# EAGLE schematic Arduino_Shield_6_5_19_REV4 (EAGLE 9.3.1)

## Sheet 1 of 2
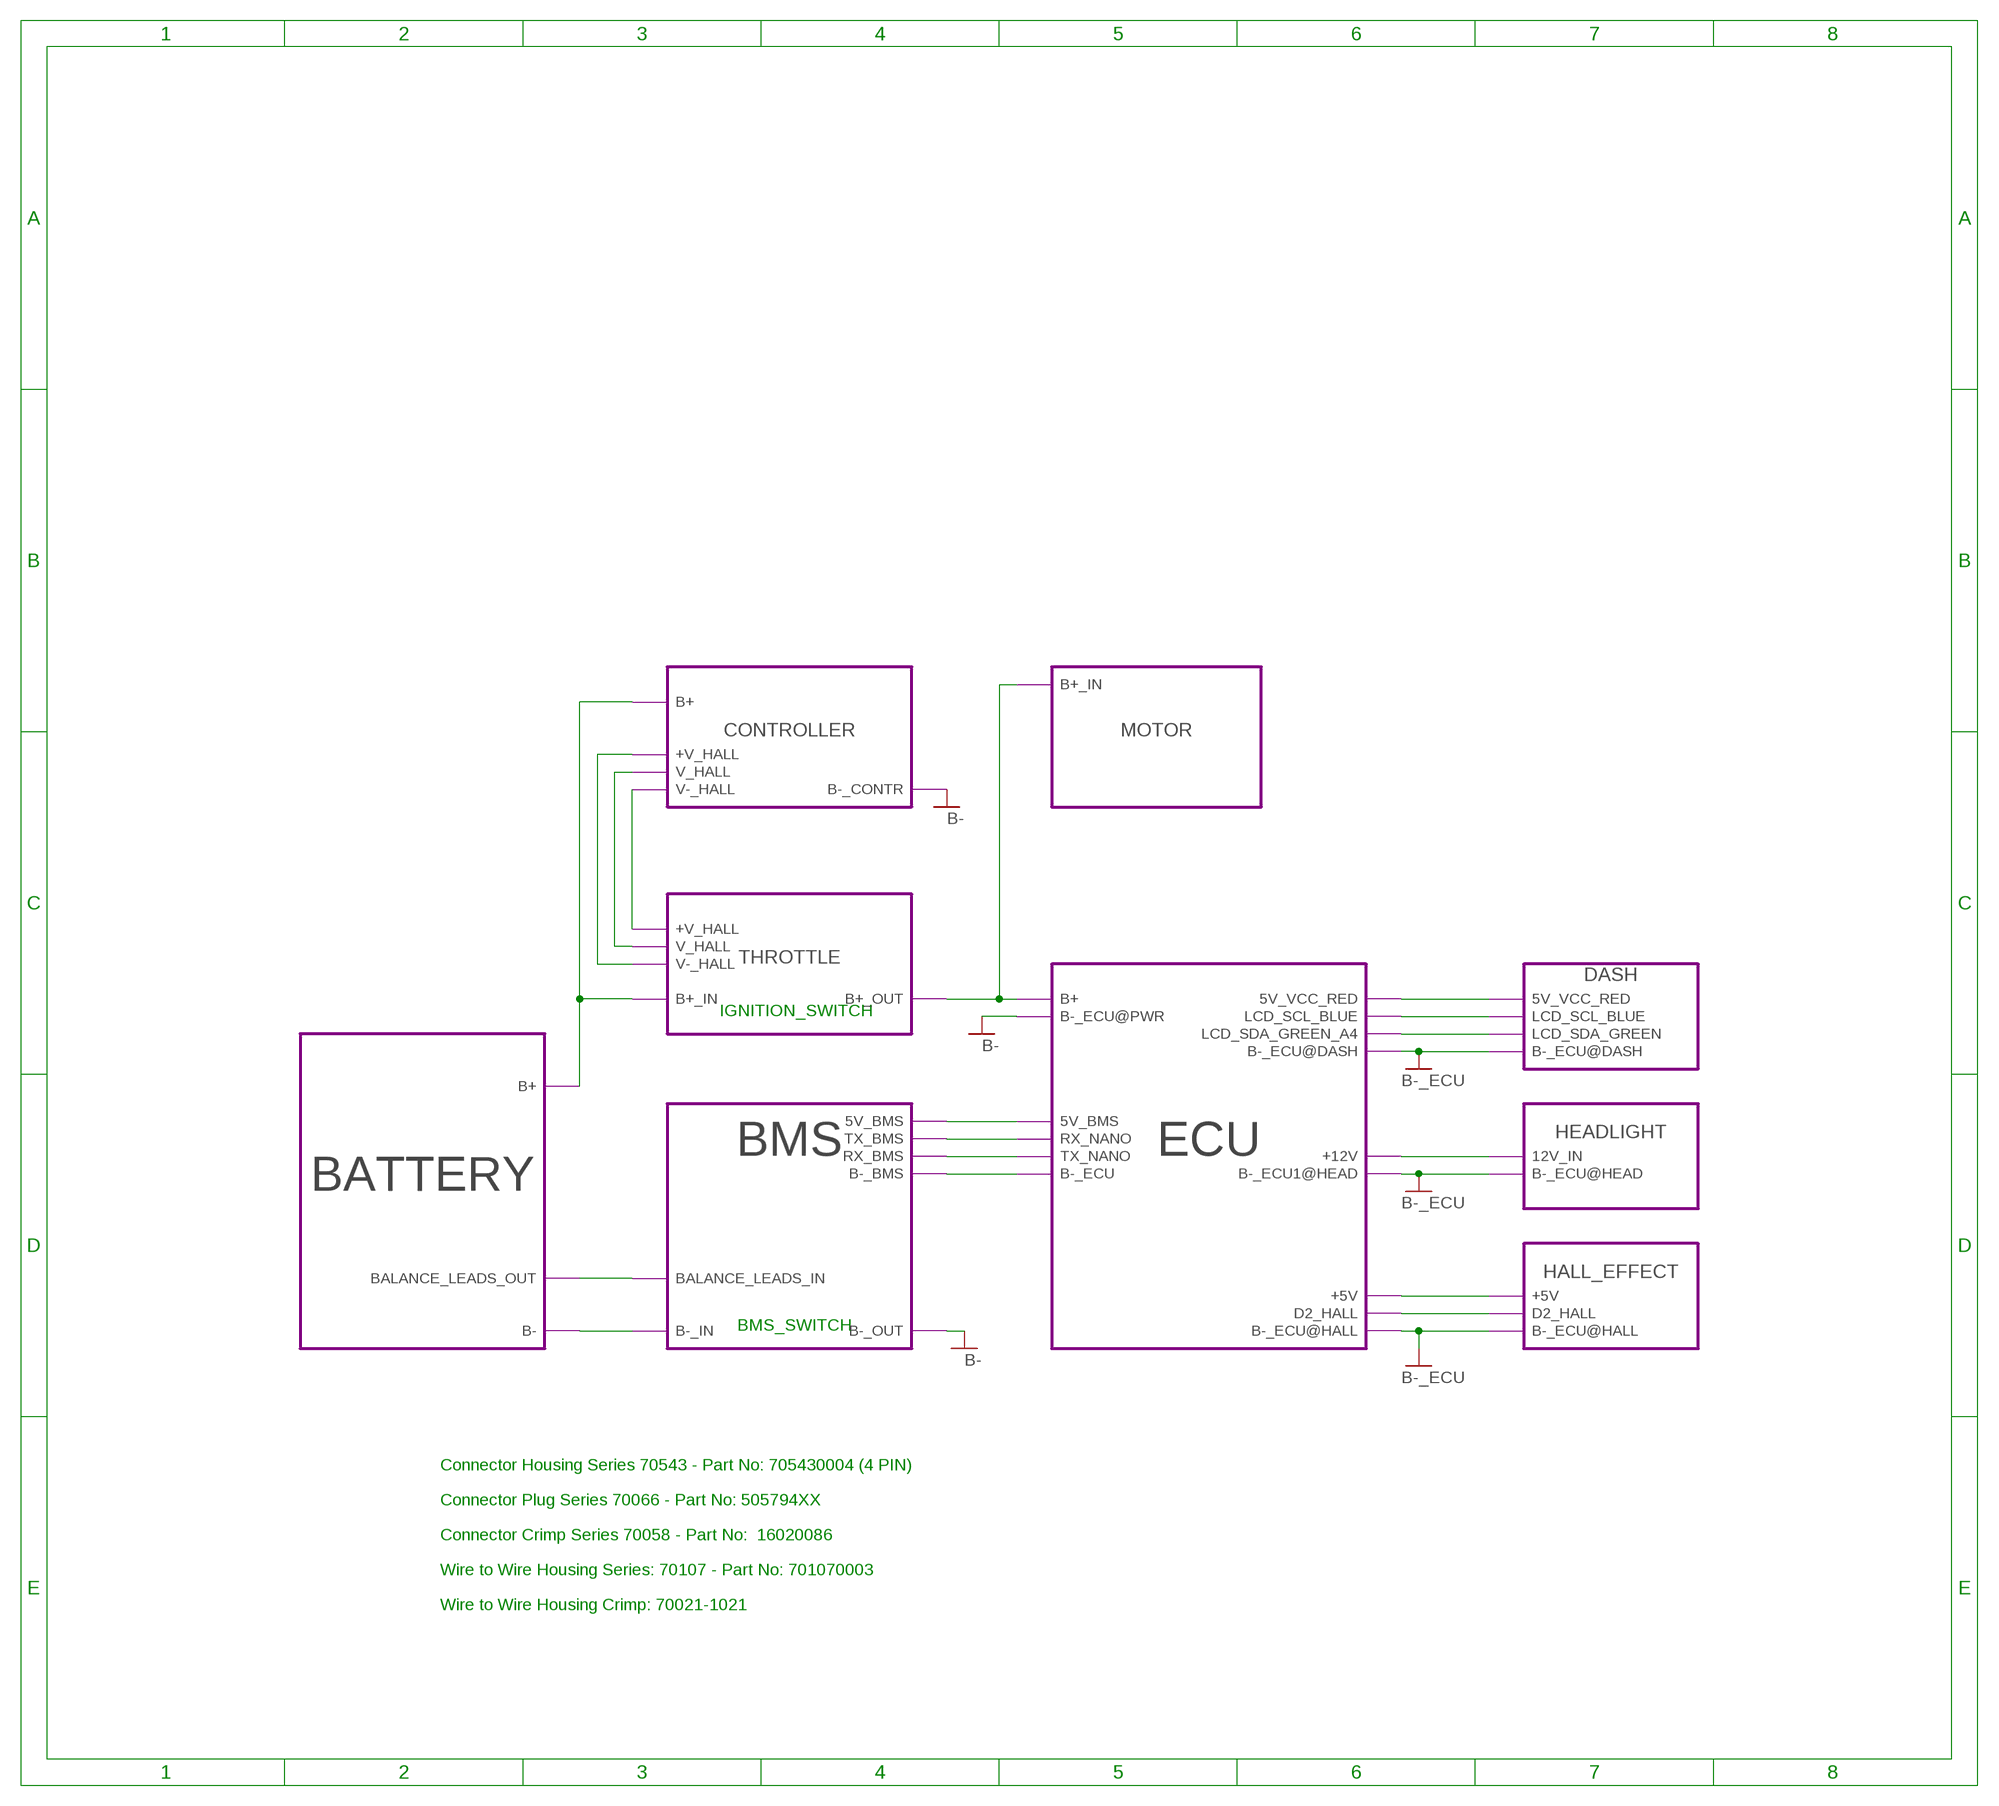
[diagram p0: schematic, sheet 1]

### Module instances
BMS = BMS
BATTERY = BATTERY
ECU = EBIKE_SYSTEM
HALL_EFFECT = HALL_EFFECT_SENSOR
DASH = HEADLIGHT/DISPLAY
HEADLIGHT = HEADLIGHT
THROTTLE = THROTTLE
CONTROLLER = CONTROLLER
MOTOR = MOTOR

### Nets
+5V: port ECU.+5V HALL_EFFECT.+5V ; also sheet 2
+12V: port ECU.+12V HEADLIGHT.12V_IN ; also sheet 2
B+: port MOTOR.B+_IN ECU.B+ THROTTLE.B+_OUT ; also sheet 2
B-: port ECU.B-_ECU@PWR CONTROLLER.B-_CONTR BMS.B-_OUT
B-_ECU: port ECU.B-_ECU@HALL HALL_EFFECT.B-_ECU@HALL ECU.B-_ECU1@HEAD HEADLIGHT.B-_ECU@HEAD ECU.B-_ECU@DASH DASH.B-_ECU@DASH BMS.B-_BMS ECU.B-_ECU ; also sheet 2
LCD_SCL: port ECU.LCD_SCL_BLUE DASH.LCD_SCL_BLUE
LCD_SDA: port ECU.LCD_SDA_GREEN_A4 DASH.LCD_SDA_GREEN
N$1: port BATTERY.B- BMS.B-_IN
N$2: port ECU.5V_VCC_RED DASH.5V_VCC_RED
N$3: port ECU.D2_HALL HALL_EFFECT.D2_HALL
N$5: port CONTROLLER.B+ BATTERY.B+ THROTTLE.B+_IN
N$6: port BMS.5V_BMS ECU.5V_BMS
N$9: port THROTTLE.+V_HALL CONTROLLER.V-_HALL
N$11: port BMS.BALANCE_LEADS_IN BATTERY.BALANCE_LEADS_OUT
N$15: port THROTTLE.V_HALL CONTROLLER.V_HALL
N$16: port CONTROLLER.+V_HALL THROTTLE.V-_HALL
RX_NANO: port BMS.TX_BMS ECU.RX_NANO
TX_NANO: port BMS.RX_BMS ECU.TX_NANO

### Notes on the sheet
- IGNITION_SWITCH
- BMS_SWITCH
- Connector Housing Series 70543 - Part No: 705430004 (4 PIN)
- Connector Plug Series 70066 - Part No: 505794XX
- Connector Crimp Series 70058 - Part No:  16020086
- Wire to Wire Housing Series: 70107 - Part No: 701070003
- Wire to Wire Housing Crimp: 70021-1021

## Sheet 2 of 2
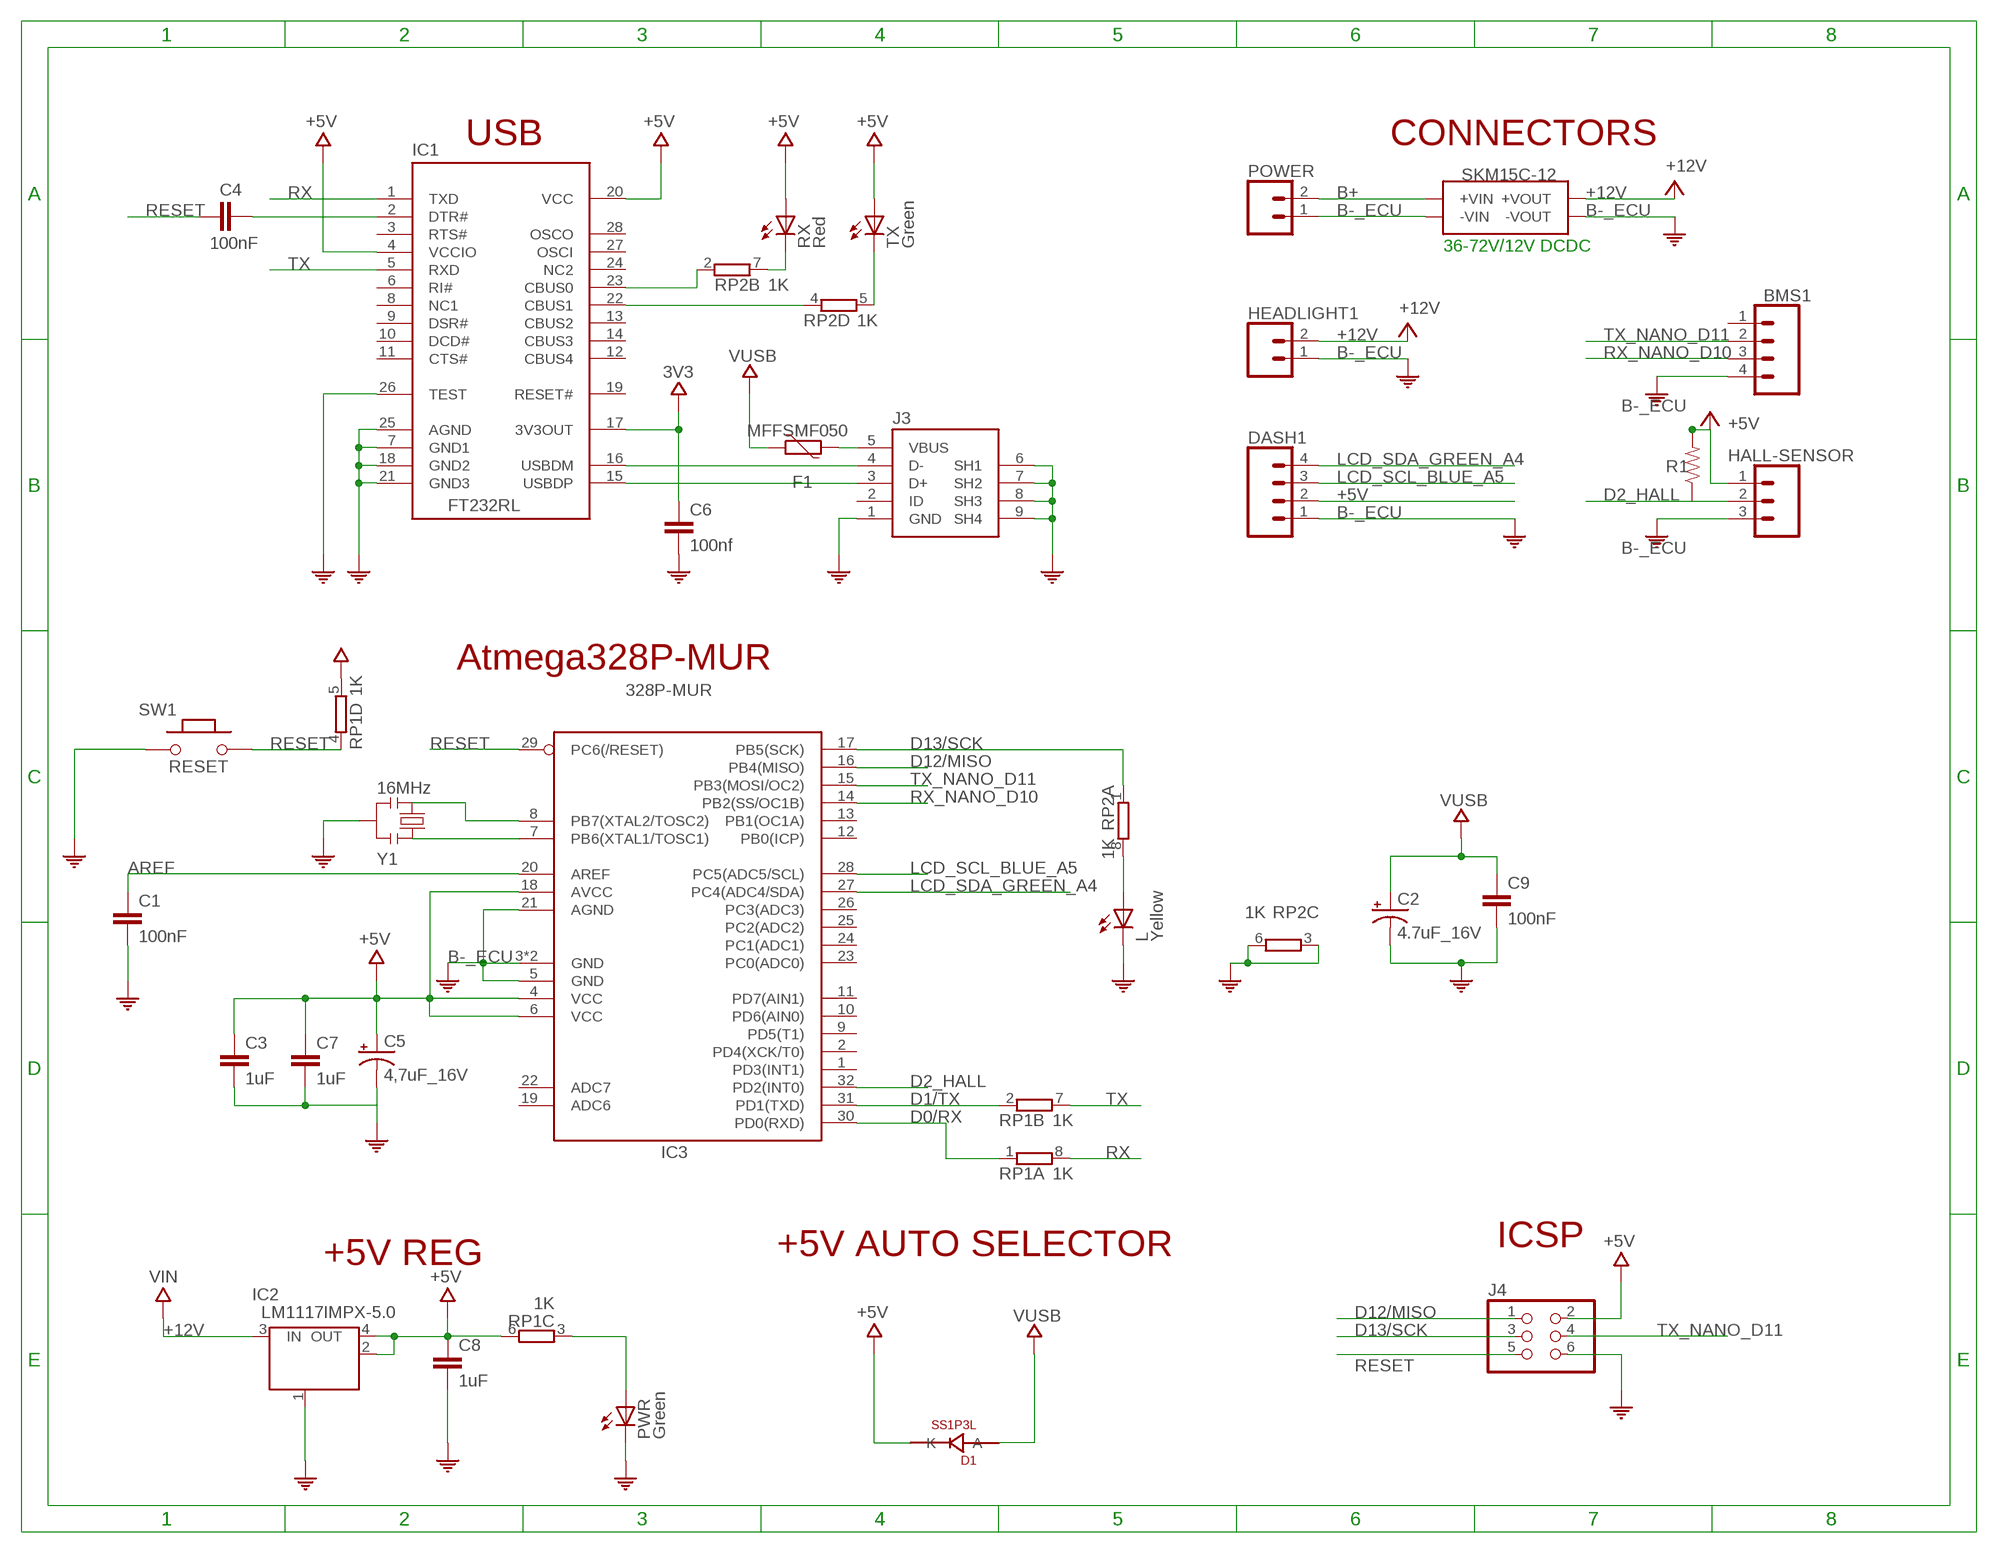
[diagram p1: schematic, sheet 2]

### Parts
BMS1  4PIN_.1"_CONNECTOR  [1X04]
C1  100nF  CAPACITOR_100NF  [0805]
C2  4.7uF_16V  CAPACITOR_POLAR_4.7UF  [0805]
C3  1uF  CAPACITOR_1UF  [0805]
C4  100nF  CAPACITOR_100NF  [0805]
C5  4,7uF_16V  CAPACITOR_POLAR_4.7UF  [0805]
C6  100nf  CAPACITOR_100NF  [0805]
C7  1uF  CAPACITOR_1UF  [0805]
C8  1uF  CAPACITOR_1UF  [0805]
C9  100nF  CAPACITOR_100NF  [0805]
D1  SS1P3L  0025_SS1P3L-M3/84A  [DO220AAL]
DASH1  4PIN_.1"_CONNECTOR  [1X04]
F1  MFFSMF050  PTC  [0603-1608X90N]
HALL-SENSOR  3PIN_.1"_CONNECTOR  [1X03]
HEADLIGHT1  2PIN_.1"_CONNECTOR  [1X02]
IC1  FT232RL  0226_FT232RL  [SSOP28]
IC2  LM1117IMPX-5.0  0022_LM1117IMPX-5.0  [LINEAR_SOT223]
IC3  328P-MUR  ATMEGA328P-32MUR  [VQFN32]
J3  0219_14850  [USB-MINI-B_2]
J4  0114_PH254-203DF118A00V  [2X03]
L  Yellow  0044_KPT-2012YC  [CHIPLED_0805]
POWER  2PIN_.1"_CONNECTOR  [1X02]
PWR  Green  0043_KPT-2012SGC  [CHIPLED_0805]
R1  0.3  RESISTOR_0805-0805-1/8W-1%  [0805]
RP1  1K  0005_064R_1K_/_CAY16-102J4LF  [CAY16]
RP2  1K  0005_064R_1K_/_CAY16-102J4LF  [CAY16]
RX  Red  0181_KTP-2012SURCK  [CHIPLED_0805]
SW1  RESET  0173_IT-1185AP1C-160G-G_T&R  [SMD_157SW]
TX  Green  0043_KPT-2012SGC  [CHIPLED_0805]
U$2  SKM15C-12_DCDC  [SKM15C-12_DCDC]
Y1  16MHz  0011_CSTCE16M0V53-R0  [RESONATOR]

### Nets
3V3: C6.1 IC1.17(3V3OUT)
+5V: C3.1 C5.1(+) C7.1 C8.1 D1.P$1(K) DASH1.2 HALL-SENSOR.1 IC1.4(VCCIO) IC1.20(VCC) IC2.2(OUT) IC2.4(OUT) IC3.4(VCC) IC3.6(VCC) IC3.18(AVCC) J4.2 R1.2 RP1.5 RP1.6 RX.A TX.A ; also sheet 1
+12V: HEADLIGHT1.2 IC2.3(IN) U$2.+VOUT ; supply symbol labelled VIN ; also sheet 1
AREF: C1.1 IC3.20(AREF)
B+: POWER.2 U$2.+VIN ; also sheet 1
B-_ECU: BMS1.4 C1.2 C2.2(-) C3.2 C5.2(-) C6.2 C7.2 C8.2 C9.2 DASH1.1 HALL-SENSOR.3 HEADLIGHT1.1 IC1.7(GND1) IC1.18(GND2) IC1.21(GND3) IC1.25(AGND) IC1.26(TEST) IC2.1(GND/ADJ) IC3.3(GND) IC3.5(GND) IC3.21(AGND) IC3.33(GND) J3.1(GND) J3.6(SH1) J3.7(SH2) J3.8(SH3) J3.9(SH4) J4.6 L.C POWER.1 PWR.C RP2.3 RP2.6 SW1.1 U$2.-VIN U$2.-VOUT Y1.2 ; supply symbol labelled COM ; also sheet 1
D0/RX: IC3.30(PD0(RXD)) RP1.1
D1/TX: IC3.31(PD1(TXD)) RP1.2
D2_HALL: HALL-SENSOR.2 IC3.32(PD2(INT0)) R1.1
D12/MISO: IC3.16(PB4(MISO)) J4.1
D13/SCK: IC3.17(PB5(SCK)) J4.3 RP2.1
LCD_SCL_BLUE_A5: DASH1.3 IC3.28(PC5(ADC5/SCL))
LCD_SDA_GREEN_A4: DASH1.4 IC3.27(PC4(ADC4/SDA))
N$4: C4.2 IC1.2(DTR#)
N$7: IC1.15(USBDP) J3.3(D+)
N$8: IC1.16(USBDM) J3.4(D-)
N$10: PWR.A RP1.3
N$12: IC1.23(CBUS0) RP2.2
N$13: IC1.22(CBUS1) RP2.4
N$14: IC3.7(PB6(XTAL1/TOSC1)) Y1.1
N$17: IC3.8(PB7(XTAL2/TOSC2)) Y1.3
N$18: L.A RP2.8
N$19: RP2.5 TX.C
N$26: F1.2 J3.5(VBUS)
N$29: RP2.7 RX.C
RESET: C4.1 IC3.29(PC6(/RESET)) J4.5 RP1.4 SW1.2
RX: IC1.1(TXD) RP1.8
RX_NANO_D10: BMS1.3 IC3.14(PB2(SS/OC1B))
TX: IC1.5(RXD) RP1.7
TX_NANO_D11: BMS1.2 IC3.15(PB3(MOSI/OC2)) J4.4
VUSB: C2.1(+) C9.1 D1.P$2(A) F1.1
Unconnected: BMS1.1 IC1.3(RTS#) IC1.6(RI#) IC1.8(NC1) IC1.9(DSR#) IC1.10(DCD#) IC1.11(CTS#) IC1.12(CBUS4) IC1.13(CBUS2) IC1.14(CBUS3) IC1.19(RESET#) IC1.24(NC2) IC1.27(OSCI) IC1.28(OSCO) IC3.1(PD3(INT1)) IC3.2(PD4(XCK/T0)) IC3.9(PD5(T1)) IC3.10(PD6(AIN0)) IC3.11(PD7(AIN1)) IC3.12(PB0(ICP)) IC3.13(PB1(OC1A)) IC3.19(ADC6) IC3.22(ADC7) IC3.23(PC0(ADC0)) IC3.24(PC1(ADC1)) IC3.25(PC2(ADC2)) IC3.26(PC3(ADC3)) J3.2(ID)

### Notes on the sheet
- USB | CONNECTORS
- 36-72V/12V DCDC
- Atmega328P-MUR
- +5V AUTO SELECTOR | ICSP
- +5V REG

## Library data of the parts
BMS1 DASH1 = EBike_Project_Library:4PIN_.1"_CONNECTOR; DESCRIPTION: Headers & Wire Housings VERTICAL HDR 4P single row; LINK: https://www.mouser.com/ProductDetail/Molex/70543-0003?qs=%2Fha2pyFaduhkrELsSyc%252BzEvQtAM%2F8u3WZn5u47QKSoI%3D; PART_NUMBER: 70543-0003; PRICE: 0.99
C1 C4 C6 C9 = EBike_Project_Library:CAPACITOR_100NF; DESCRIPTION: Multilayer Ceramic Capacitors MLCC - SMD/SMT 0805 50V 0.1uF 10% X7R AEC-Q200; LINK: https://www.mouser.com/ProductDetail/Taiyo-Yuden/UMK212B7104KGHT?qs=sGAEpiMZZMs0AnBnWHyRQNbg85K4ab%2F3SCTzhAxY5ms%3D; PACKAGE: 0805; PART_NUMBER: UMK212B7104KGHT; PRICE: 0.073
C2 C5 = EBike_Project_Library:CAPACITOR_POLAR_4.7UF; DESCRIPTION: Tantalum Capacitors - Solid SMD 16volts 4.7uF 20% Molded Case, 0805; LINK: https://www.mouser.com/ProductDetail/Vishay-Sprague/TMCP1C475MTRF?qs=sGAEpiMZZMuEN2agSAc2prL8TSVBEr4qhfGzNWmpY58%252BLcjxpCNYUg%3D%3D; PART_NUMBER: TMCP1C475MTRF; PRICE: 0.62
C3 C7 C8 = EBike_Project_Library:CAPACITOR_1UF; DESCRIPTION: Multilayer Ceramic Capacitors MLCC - SMD/SMT CGA 0805 16V 1uF X7R 10% AEC-Q200; LINK: https://www.mouser.com/ProductDetail/TDK/CGA4J2X7R1C105K125AA?qs=sGAEpiMZZMs0AnBnWHyRQEWjzA2rN6H9wYlJX5ghAes%3D; PACKAGE: 0805; PART_NUMBER: CGA4J2X7R1C105K125AA; PRICE: 0.08
D1 = Diodi:0025_SS1P3L-M3/84A: 1A 30V Schottky Barrier Rectifiers -SS1P3L-M3/84A; CASE: SMP; MONTHLY_USAGE: _____; PART_NUMBER: SS1P3L-M3/84A; PRICE: _____; SUPPLIER: _____; TYPE: Diodi
F1 = Arduino-rcl:PTC: SMD PTC; DATASHEET: http://www.bourns.com/docs/Product-Datasheets/mffsmf.pdf; DISTRIBUTOR-LINK: http://www.digikey.com/product-detail/en/bourns-inc/MF-FSMF050X-2/MF-FSMF050X-2CT-ND/2039389; DISTRIBUTOR-PN: MF-FSMF050X-2CT-ND; MANUFACTURER: Bourns Inc; MANUFACTURER-PN: MF-FSMF050X-2
HALL-SENSOR = EBike_Project_Library:3PIN_.1"_CONNECTOR; DESCRIPTION: Headers & Wire Housings VERTICAL HDR 3P single row; LINK: https://www.mouser.com/ProductDetail/Molex/70543-0002?qs=sGAEpiMZZMtVoztFdqDXO7H2KtVwxa9m; PART_NUMBER: 70543-0002; PRICE: 0.92
HEADLIGHT1 POWER = EBike_Project_Library:2PIN_.1"_CONNECTOR; DESCRIPTION: Headers & Wire Housings VERTICAL HDR 2P single row; LINK: https://www.mouser.com/ProductDetail/Molex/70543-0001?qs=sGAEpiMZZMtVoztFdqDXOwZ%252B3K3gi96X; PART_NUMBER: 70543-0001; PRICE: 0.84
IC1 = IntegratedCircuits:0226_FT232RL: USB to serial UART interface -FT232RL; CASE: SSOP28; MONTHLY_USAGE: _____; PART_NUMBER: FT232RL; PRICE: _____; SUPPLIER: _____; TYPE: Circuito_Integrato
IC2 = IntegratedCircuits:0022_LM1117IMPX-5.0: Low-dropout linear regulator 5V -LM1117IMPX-5.0; CASE: SOT223; MONTHLY_USAGE: _____; PART_NUMBER: LM1117IMPX-5.0; PRICE: _____; SUPPLIER: _____; TYPE: Circuito_Integrato
IC3 = Arduino-ucs&SoCs:ATMEGA328P-32: 8-bit Microcontroller with 32KBytes In-System Programmable Flash ATMEGA328P-AU; DATASHEET: http://www.atmel.com/images/Atmel-8271-8-bit-AVR-Microcontroller-ATmega48A-48PA-88A-88PA-168A-168PA-328-328P_datasheet_Complete.pdf; DISTRIBUTOR-LINK: https://www.digikey.it/product-detail/it/microchip-technology/ATMEGA328P-MUR/ATMEGA328P-MURCT-ND/3440953; DISTRIBUTOR-PN: ATMEGA328P-MURCT-ND; MANUFACTURER: ATMEL; MANUFACTURER-PN: ATMEGA328P-MUR
J3 = Connettori:0219_14850: Usb-Mini F 90 Smd; MONTHLY_USAGE: _____; PART_NUMBER: 14850; PRICE: _____; SUPPLIER: _____; TYPE: Connettori; VALUE: USB-mini-90 -SMD
J4 = Connettori:0114_PH254-203DF118A00V: 3x2 M V h 8,5 mm p2,54; MONTHLY_USAGE: _____; PART_NUMBER: PH254-203DF118A00V; PRICE: _____; SUPPLIER: _____; TYPE: Connettori; VALUE: ICSP
L = Opto:0044_KPT-2012YC: LED YELLOW - SMD - 0805; MONTHLY_USAGE: _____; PART_NUMBER: KPT-2012YC; PRICE: _____; SUPPLIER: _____; TYPE: Opto
PWR TX = Opto:0043_KPT-2012SGC: LED GREEN - SMD-0805; MONTHLY_USAGE: _____; PART_NUMBER: KPT-2012SGC; PRICE: _____; SUPPLIER: _____; TYPE: Opto
R1 = EBike_Project_Library:RESISTOR_0805: 0.3Ω resistor A resistor is a passive two-terminal electrical component that implements electrical resistance as a circuit element. Resistors act to reduce current flow, and, at the same time, act to lower voltage levels within circuits. - Wikipedia; PROD_ID: RES-11622
RP1 RP2 = Resistenze:0005_064R_1K_/_CAY16-102J4LF: 1K 064R; CASE: SMD_3,2x1,6; MONTHLY_USAGE: _____; PART_NUMBER: 064R_1K_/_CAY16-102J4LF; PRICE: _____; SUPPLIER: _____; TYPE: Resistenze
RX = Opto:0181_KTP-2012SURCK: LED RED - SMD - 0805; MONTHLY_USAGE: _____; PART_NUMBER: KTP-2012SURCK; PRICE: _____; SUPPLIER: _____; TYPE: Opto
SW1 = Switches:0173_IT-1185AP1C-160G-G_T&R: Pushbutton 4x3 SMD H2,5mm; MONTHLY_USAGE: _____; PART_NUMBER: IT-1185AP1C-160G-G_T&R; PRICE: _____; SUPPLIER: _____; TYPE: Switches; VALUE: 157SW
U$2 = EBike_Project_Library:SKM15C-12_DCDC; DESCRIPTION: Isolated DC/DC Converters 15W 36-75Vin 12Vout 125-1250mA 1x1 size; LINK: https://www.mouser.com/ProductDetail/MEAN-WELL/SKM15C-12?qs=%2Fha2pyFaduhh55LLYaK%2FKJ2VcEvgwt5xUEx7a8eNZIE%3D; PART_NUMBER: SKM15C-12; PRICE: 25.44
Y1 = Cristalli:0011_CSTCE16M0V53-R0: 16Mhz - SMD; MONTHLY_USAGE: _____; PART_NUMBER: CSTCE16M0V53-R0; PRICE: _____; SUPPLIER: _____; TYPE: Cristalli; VALUE: CSTCE16M0V53-R0

## Module BMS
Ports: BALANCE_LEADS_IN(pwr) B-_IN(pwr) B-_OUT(pwr) 5V_BMS(pas) TX_BMS(pas) RX_BMS(pas) B-_BMS(pas)

### Library data of the parts

## Module BATTERY
Ports: B+(pwr) B-(pwr) BALANCE_LEADS_OUT(pwr)

### Library data of the parts

## Module EBIKE_SYSTEM
Ports: +5V(pwr) D2_HALL(pwr) B-_ECU@HALL(pwr) 5V_BMS(pas) RX_NANO(pas) TX_NANO(pas) 5V_VCC_RED(pwr) LCD_SCL_BLUE(pwr) LCD_SDA_GREEN_A4(pwr) B-_ECU@DASH(pwr) B+(pwr) +12V(pwr) B-_ECU(pwr) B-_ECU1@HEAD(pwr) B-_ECU@PWR(pwr)

### Library data of the parts

## Module HALL_EFFECT_SENSOR
Ports: +5V(pwr) D2_HALL(pwr) B-_ECU@HALL(pwr)

### Library data of the parts

## Module HEADLIGHT/DISPLAY
Ports: 5V_VCC_RED(pwr) B-_ECU@DASH(pwr) LCD_SCL_BLUE(pwr) LCD_SDA_GREEN(pwr)

### Library data of the parts

## Module HEADLIGHT
Ports: 12V_IN(pwr) B-_ECU@HEAD(pwr)

### Library data of the parts

## Module THROTTLE
Ports: B+_IN(pwr) +V_HALL(pwr) V_HALL(pwr) V-_HALL(pwr) B+_OUT(pwr)

### Library data of the parts

## Module CONTROLLER
Ports: B+(pwr) B-_CONTR(pwr) +V_HALL(pwr) V_HALL(pwr) V-_HALL(pwr)

### Library data of the parts

## Module MOTOR
Ports: B+_IN(pwr)

### Library data of the parts

## Net classes
1 POWER: width 0.762 mm, clearance 0.762 mm